# Altium project power_supply.PrjPcb
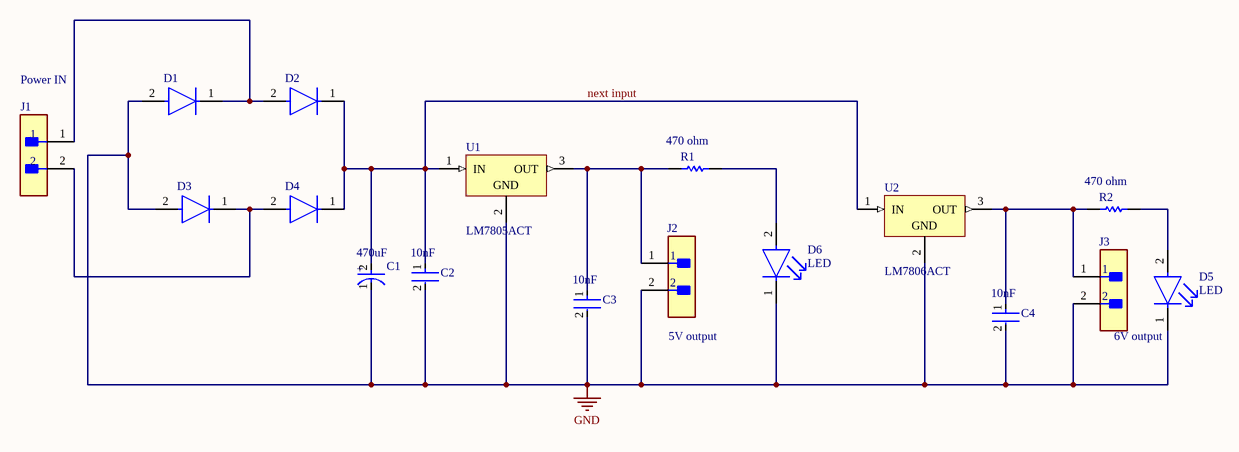
[diagram p0: Power_Supply.SchDoc]
1 sheet, 17 parts. Net scope: global (net labels, ports and power ports of the same name join across sheets).
Board file: Power_Supply.PcbDoc

## Sheet Power_Supply.SchDoc
size A; SheetNumber: 2; SheetTotal: 2

### Parts
C1  Capacitance: 470uF  [FP-RAD-TH-D_16_0_5-L_15_1-MFG]  (hidden comment: EEUTA1H331S)
C2  Capacitance: 10nF  [FP-RCE0K1-MFG]  (hidden comment: RCER71H103K0K1H03B)
C3  Capacitance: 10nF  [FP-RCE0K1-MFG]  (hidden comment: RCER71H103K0K1H03B)
C4  Capacitance: 10nF  [FP-RCE0K1-MFG]  (hidden comment: RCER71H103K0K1H03B)
D1  1N4007  [FP-1N4007-MFG]  (value not drawn)
D2  1N4007  [FP-1N4007-MFG]  (value not drawn)
D3  1N4007  [FP-1N4007-MFG]  (value not drawn)
D4  1N4007  [FP-1N4007-MFG]  (value not drawn)
D5  LED  [FP-HLMP-4700-MFG]
D6  LED  [FP-HLMP-4700-MFG]
J1  TSW-102-07-L-S  [FP-TSW-102-07-L-S-MFG]  (value not drawn)
J2  TSW-102-07-L-S  [FP-TSW-102-07-L-S-MFG]  (value not drawn)
J3  TSW-102-07-L-S  [FP-TSW-102-07-L-S-MFG]  (value not drawn)
R1  Resistance: 470 ohm  [RESA60-630X240]  (hidden comment: MFR-25FBF52-1K)
R2  Resistance: 470 ohm  [RESA60-630X240]  (hidden comment: MFR-25FBF52-1K)
U1  LM7805ACT  [FAIR-TO-220-3]
U2  LM7806ACT  [FAIR-TO-220-3]

### Nets
GND: C1.1(C) C2.2 C3.2 C4.2 D1.2(A) D3.2(A) D5.1(C) D6.1(C) J2.2 J3.2 U1.2(GND) U2.2(GND)
next input: C1.2(A) C2.1 D2.1(C) D4.1(C) U1.1(IN) U2.1(IN)
NetC3_1: C3.1 J2.1 R1.1 U1.3(OUT)
NetC4_1: C4.1 J3.1 R2.1 U2.3(OUT)
NetD1_1: D1.1(C) D2.2(A) J1.1
NetD3_1: D3.1(C) D4.2(A) J1.2
NetD5_2: D5.2(A) R2.2
NetD6_2: D6.2(A) R1.2

### Notes on the sheet
- Power IN
- (near J2) 5V output
- 6V output
- (in symbol CMP-05427-000770-1) +

### Library data of the parts
C1 = CMP-05427-000770-1: Aluminum Electrolytic Capacitors (Radial Lead Type) AEC-Q200 Qualified 330uF ±20% 50V; Lead Diameter: 0.8mm; Life (Hours): 2000Hour; Ripple Current: 1.45A; Case/Package: Radial; Voltage Rating (DC): 50V; RoHS Compliant: Yes; Length: 15mm; Tolerance: 20%; Series: TA; Diameter: 16mm; Voltage Rating: 50V; Packaging: Bulk; REACH SVHC: No SVHC; Max Operating Temperature: 125°C; Termination: Radial; Package Quantity: 100; Radiation Hardening: No; Height: 15mm; Lead Pitch: 7.5mm; Number of Pins: 2; Mount: Through Hole; Min Operating Temperature: -40°C
C2-C4 = CMP-06035-044411-1: Cap Ceramic 10nF 50V X7R ±10% Radial 5mm +125°C Automotive Bulk; Lead/Base Style: Formed Leads; Lead Diameter: 0.5mm; Resistor Type: Ceramic; Mount: Through Hole; Lead Pitch: 0.197inch; Package Quantity: 500; Dielectric: X7R; Lead Free: Lead Free; Min Operating Temperature: -55°C; Packaging: Bulk; Width: 0.098inch; Length: 0.142inch; Voltage Rating: 50V; Case/Package: Radial; Max Operating Temperature: 125°C; Ratings: AEC-Q200; Height - Seated (Max): 0.138inch; Height: 3.5mm; Termination: Radial; Voltage Rating (DC): 50V; Tolerance: 10%
D1-D4 = CMP-123542-000001-1: Rectifier diode 1000 V 1 A DO-41, ,; Manufacturer: Diotec; Max Surge Forward Current: 27A; Forward Current: 1A; Max Junction Temp: +175°C; Reverse Voltage: 1000V; Value: 15pF; Peak Reverse Current: 5uA; Category: Diode; Temperature Range Low: -50°C; Automotive: No; Temperature: -50°C to +175°C; Lead Free: Yes; ComponentLink2Description: Datasheet; Max Repetitive Reverse Voltage: 1000V; ComponentLink2URL: https://datasheet.octopart.com/1N4007-Diotec-datasheet-62346875.pdf; Manufacturer Part Number: 1N4007; Device Class L3: Rectifier Diodes; Height: 2.8mm; Octopart: https://octopart.com/1n4007-diotec-4040411; Package: 1N4007; Temperature Range High: +175°C; Device Class L1: Discrete Semiconductors; Device Class L2: Diodes; RoHS: TRUE; Capacitance: 15pF; Ipc Land Pattern Name: DIOAD888W100L520D280
D5 D6 = CMP-18399-000008-1: LED RED DIFFUSED T-1 3/4 T/H; Manufacturer: Broadcom; Luminous Intensity: 2.3mcd; Peak Emmision Wavelength: 635nm; Forward Voltage: 1.7V; Viewing Angle: 50°; Led Orientation: Straight; Reverse Voltage: 5V; Forward Current: 2mA; Power Dissipation: 14mW; Wavelength: 626nm; Digikey Description: LED RED DIFFUSED T-1 3/4 T/H; Device Class L3: unset; Temperature Range Low: -40°C; Temperature Range High: +100°C; RoHS: TRUE; Package: HLMP-4700; Octopart: https://octopart.com/hlmp-4700-broadcom-71130526; Automotive: No; ComponentLink2URL: https://docs.broadcom.com/docs/AV02-1557EN; Colour: Red; Temperature: -40°C to +100°C; Lead Free: Yes; Category: Diode; ComponentLink2Description: Datasheet; Manufacturer Part Number: HLMP-4700; Device Class L1: Optoelectronics; Device Class L2: LEDs; Mouser Description: LED; Red; 2.3mcd; 0.24In.Dia.; T-1-3/4; 500mA; 1.7V; 635nm; 50deg; 5V; 24mW; -55degC;
J1-J3 = CMP-02766-001428-1: CONN HEADER VERT 2POS 2.54MM; Voltage Rating: 550V; Current Rating: 7.6A; Gender: Male; Number of Contacts: 2; Connector Type: Male Pin; Radiation Hardening: No; Orientation: Straight; Contact Plating: Gold; Max Operating Temperature: 125°C; Mount: Through Hole; Package Quantity: 1; Number of Rows: 1; Housing Material: Polyester; RoHS Compliant: Yes; Length: 5.08mm; Max Voltage Rating (AC): 550V; Pitch: 2.54mm; Packaging: Bulk; Depth: 2.54mm; Termination: Solder; Min Operating Temperature: -55°C; Housing Color: Black; Lead Free: Lead Free; Color: Black; Number of Positions: 2; Width: 2.54mm; Max Current Rating: 7.6A; REACH SVHC: No SVHC; Contact Material: Bronze; Contact Mating Length: 0.23inch; Series: TSW; Contact Type: Male Pin
R1 R2 = CMP-1659-00075-1: Axial Resistor, 1 KOhm, +/- 1%, 250 mW, -55 to 155 degC, 2-Pin THD, RoHS, Bulk; Voltage Rating: 250 V; Power Rating: 250 mW; ComponentLink2Description: Datasheet; RoHSCompliant: true; PackageReference: MFR-25; Case\Package: Axial; Max Operating Temperature: 155 degC; DatasheetVersion: Apr-13; Tolerance: 1%; ComponentLink1URL: http://www.yageo.com/; Length: 0.248 inch; ComponentLink2URL: http://www.yageo.com/documents/recent/Yageo%20LR_MFR_2013.pdf; Packaging: Bulk; Package Quantity: 200; PackageDescription: 2-Pin Axial Lead, Dia 2.4 mm, Body Length 6.3 mm; Min Operating Temperature: -55 degC; ComponentLink1Description: Manufacturer URL
U1 U2 = CMP-2000-04937-1: Positive Voltage Regulator, 5 V, 1 A, 0 to 125 degC, 3-Pin TO-220, RoHS, Tube; Manufacturer: Fairchild; Number of Outputs: 1; Typical Dropout Voltage @ Current: 2V@1A; Output Type: Fixed; Output Voltage: 5V; Quiescent Current: 6mA; Dropout Voltage Measurement Current: 1A; Line Regulation: 50mV; Maximum Input Voltage: 35V; Regulator Function: Linear; Load Regulation: 100mV; Package Type: TO-220; Mounting Type: ThroughHole; Height: 16.51mm; Maximum Operating Temperature: +125degC; Datasheet Version: Rev. 1.0.1, 05/2006; Package Reference: TO-220; Minimum Operating Temperature: 0degC; Manufacturer URL: https://www.fairchildsemi.com/; Package URL: https://www.fairchildsemi.com/package-drawings/TO/TO220B03.pdf; Length: 10.67mm; Series: LM78xx; Dimensions: 10.67x4.83x16.51mm; Polarity: Positive; Maximum Output Current: 1A; Pin Count: 3; Width: 4.83mm; Package Description: 3-Pin Through Hole Device, Body 10 x 4.5 mm, Pitch 2.54 mm; Datasheet URL: https://datasheet.ciiva.com/5816/1359194-5816420.pdf